# Altium schematic sheet SCH_BTL_GR6.SchDoc
size A
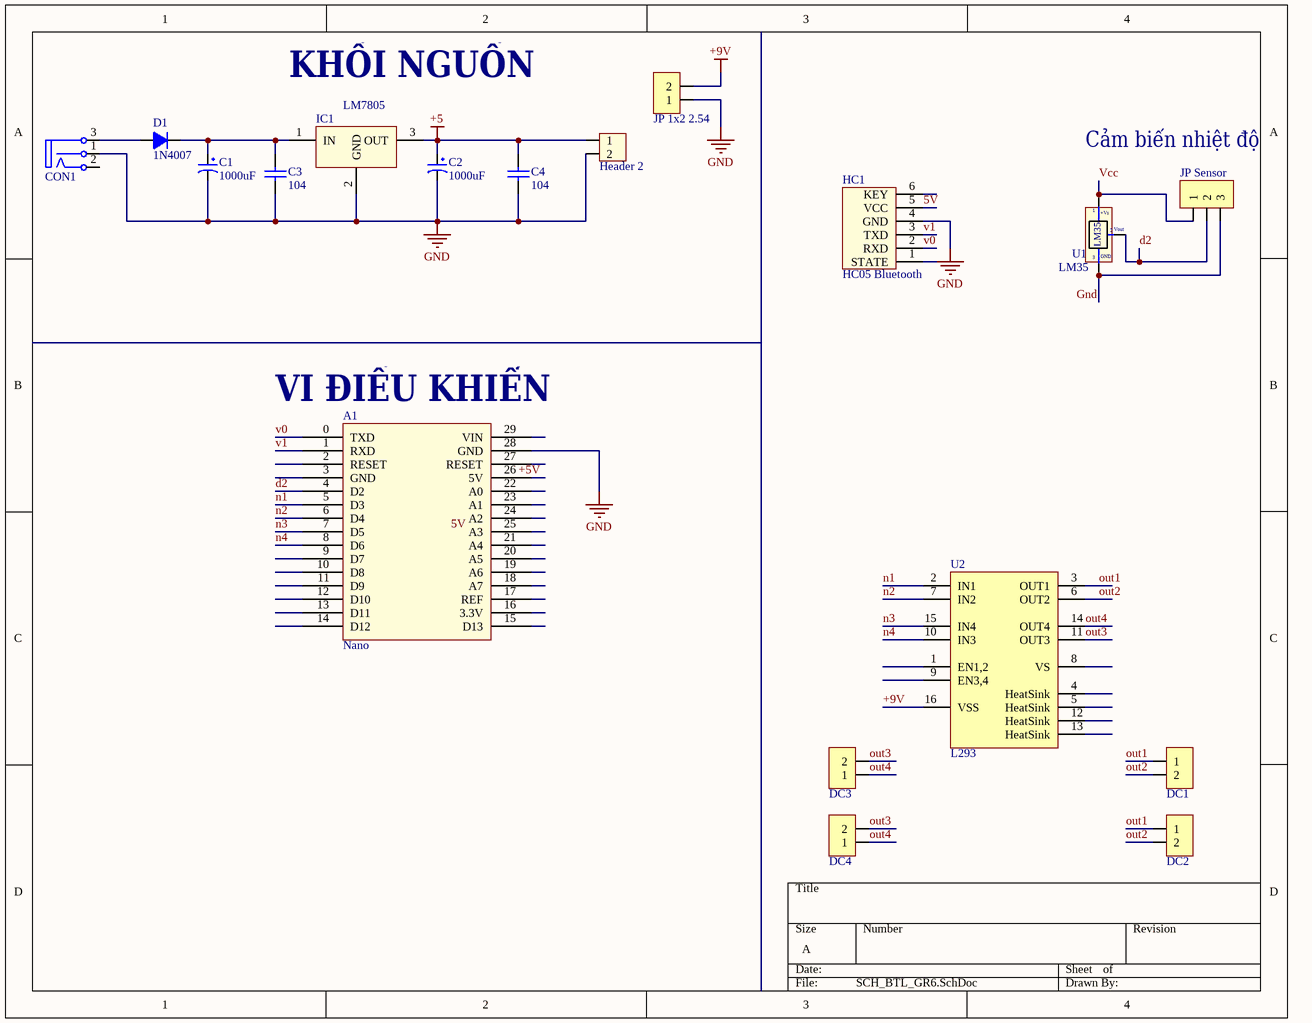
[diagram p0: SCH_BTL_GR6.SchDoc]

## Parts
A1  Nano  [Arduino nano]
C1  1000uF  [tu hoa 8mm]
C2  1000uF  [tu hoa 8mm]
C3  104  [tu gom]
C4  104  [tu gom]
CON1  CON DC PWR  [CONN/DC/PWR/5.0MM]  (value not drawn)
D1  1N4007  [D1A]
H1  Header 2  [Header 2P DC 2.54]
HC1  HC05 Bluetooth  [HC05 Bluethooth Dung]
IC1  LM7805  [QTO-220]
JP1  JP 1x2 2.54  [JP 1x2 CC]
JP2  JP Sensor  [JP 1x3 CT]
JP3  DC3  [JP 1x2 CC]
JP4  DC1  [JP 1x2 CC]
JP5  DC4  [JP 1x2 CC]
JP6  DC2  [JP 1x2 CC]
U1  LM35  [QTO-92]
U2  L293  [DIP 16]

## Nets
+5: C2.1 C4.1 H1.1 IC1.3(OUT)
+9V: JP1.2 U2.16(VSS)
Gnd: A1.28(GND) C1.2 C2.2 C3.2 C4.2 CON1.1(S) H1.2 HC1.4(GND) IC1.2(GND) JP1.1 JP2.3 U1.3(-)
5V: HC1.5(VCC)
d2: A1.4(D2) JP2.2 U1.2(Vout)
n1: A1.5(D3) U2.2(IN1)
n2: A1.6(D4) U2.7(IN2)
n3: A1.7(D5) U2.15(IN4)
n4: A1.8(D6) U2.10(IN3)
out1: JP4.1 JP6.1 U2.3(OUT1)
out2: JP4.2 JP6.2 U2.6(OUT2)
out3: JP3.2 JP5.2 U2.11(OUT3)
out4: JP3.1 JP5.1 U2.14(OUT4)
v0: A1.0(TXD) HC1.2(RXD)
v1: A1.1(RXD) HC1.3(TXD)
Vcc: JP2.1 U1.1(+Vs)
NetC1_1: C1.1 C3.1 D1.2(K) IC1.1(IN)
NetCON1_3: CON1.3(TN) D1.1(A)

Not connected (* = marked no-connect by the designer): A1 2(RESET) 3(GND) 9(D7) 10(D8) 11(D9) 12(D10) 13(D11) 14(D12) 15(D13) 16(3.3V) 17(REF) 18(A7) 19(A6) 20(A5) 21(A4) 22(A0) 23(A1) 24(A2) 25(A3) 26(5V) 27(RESET) 29(VIN); CON1 2(T); HC1 1(STATE) 6(KEY); U2 1(EN1,2) 4(HeatSink) 5(HeatSink) 8(VS) 9(EN3,4) 12(HeatSink) 13(HeatSink)

## Notes on the sheet
- KHỐI NGUỒN
- Cảm biến nhiệt độ
- (near A1) VI ĐIỀU KHIỂN
- Labels drawn without touching a wire or pin: 5V, +5V
- (in symbol LM35) GND

## Library data of the parts
A1 = Arduino Nano
C1 C2 = Tu Hoa 1000uF 16V 8x20: Cắm; Don_Vi: Con; So_Chan: 2; Ten_Linh_Kien: Tụ Hóa 1000uF 16V 8x20MM; Ma_Hang: MH008300; Chung_Loai: Cắm; Kieu_Chan: *
C3 C4 = Tu gom 104 50V: Cắm; So_Chan: 2; Ten_Linh_Kien: Tụ gốm 104 100nF 50V; Don_Vi: Con; Ma_Hang: MH004761; Chung_Loai: Cắm; Kieu_Chan: *
CON1 = CON DC PWR: DC input connector
D1 = D1A: Diode 1A; Value: 1N4007
H1 = Header 2P 2.54 Duc Cong: Cắm; Ten_Linh_Kien: Header 2P XH2.54-2P Đực Cong; Don_Vi: Con; Ma_Hang: MH002852; Chung_Loai: Cắm
HC1 = HC05 Bluetooth: Bluetooth HC05; Value: Connector 6
IC1 = LM78xx: On ap +, from + 5 to + 24VDC; Value: LM7805
JP1 JP3-JP6 = JP 1x2 2.54 Cai Cong: Cắm; Ten_Linh_Kien: Jump Đơn Cái 2.54MM 1x40P Cong; Don_Vi: Con; Ma_Hang: MH001265; Ghi_Chu: *; Kieu_Chan: *; Chung_Loai: Cắm
JP2 = JP 1x3 2.54 Cai Thang: Cắm; Ten_Linh_Kien: Jump Đơn Cái 2.54MM 1x20P Thẳng; Don_Vi: Con; Ma_Hang: MH004006; Ghi_Chu: *; Kieu_Chan: *; Chung_Loai: Cắm
U1 = LM35: Teminal; Value: LM35
U2 = L293: Quadruple Half-H drivers